# EAGLE design cvocd-a (EAGLE 6.6.0)
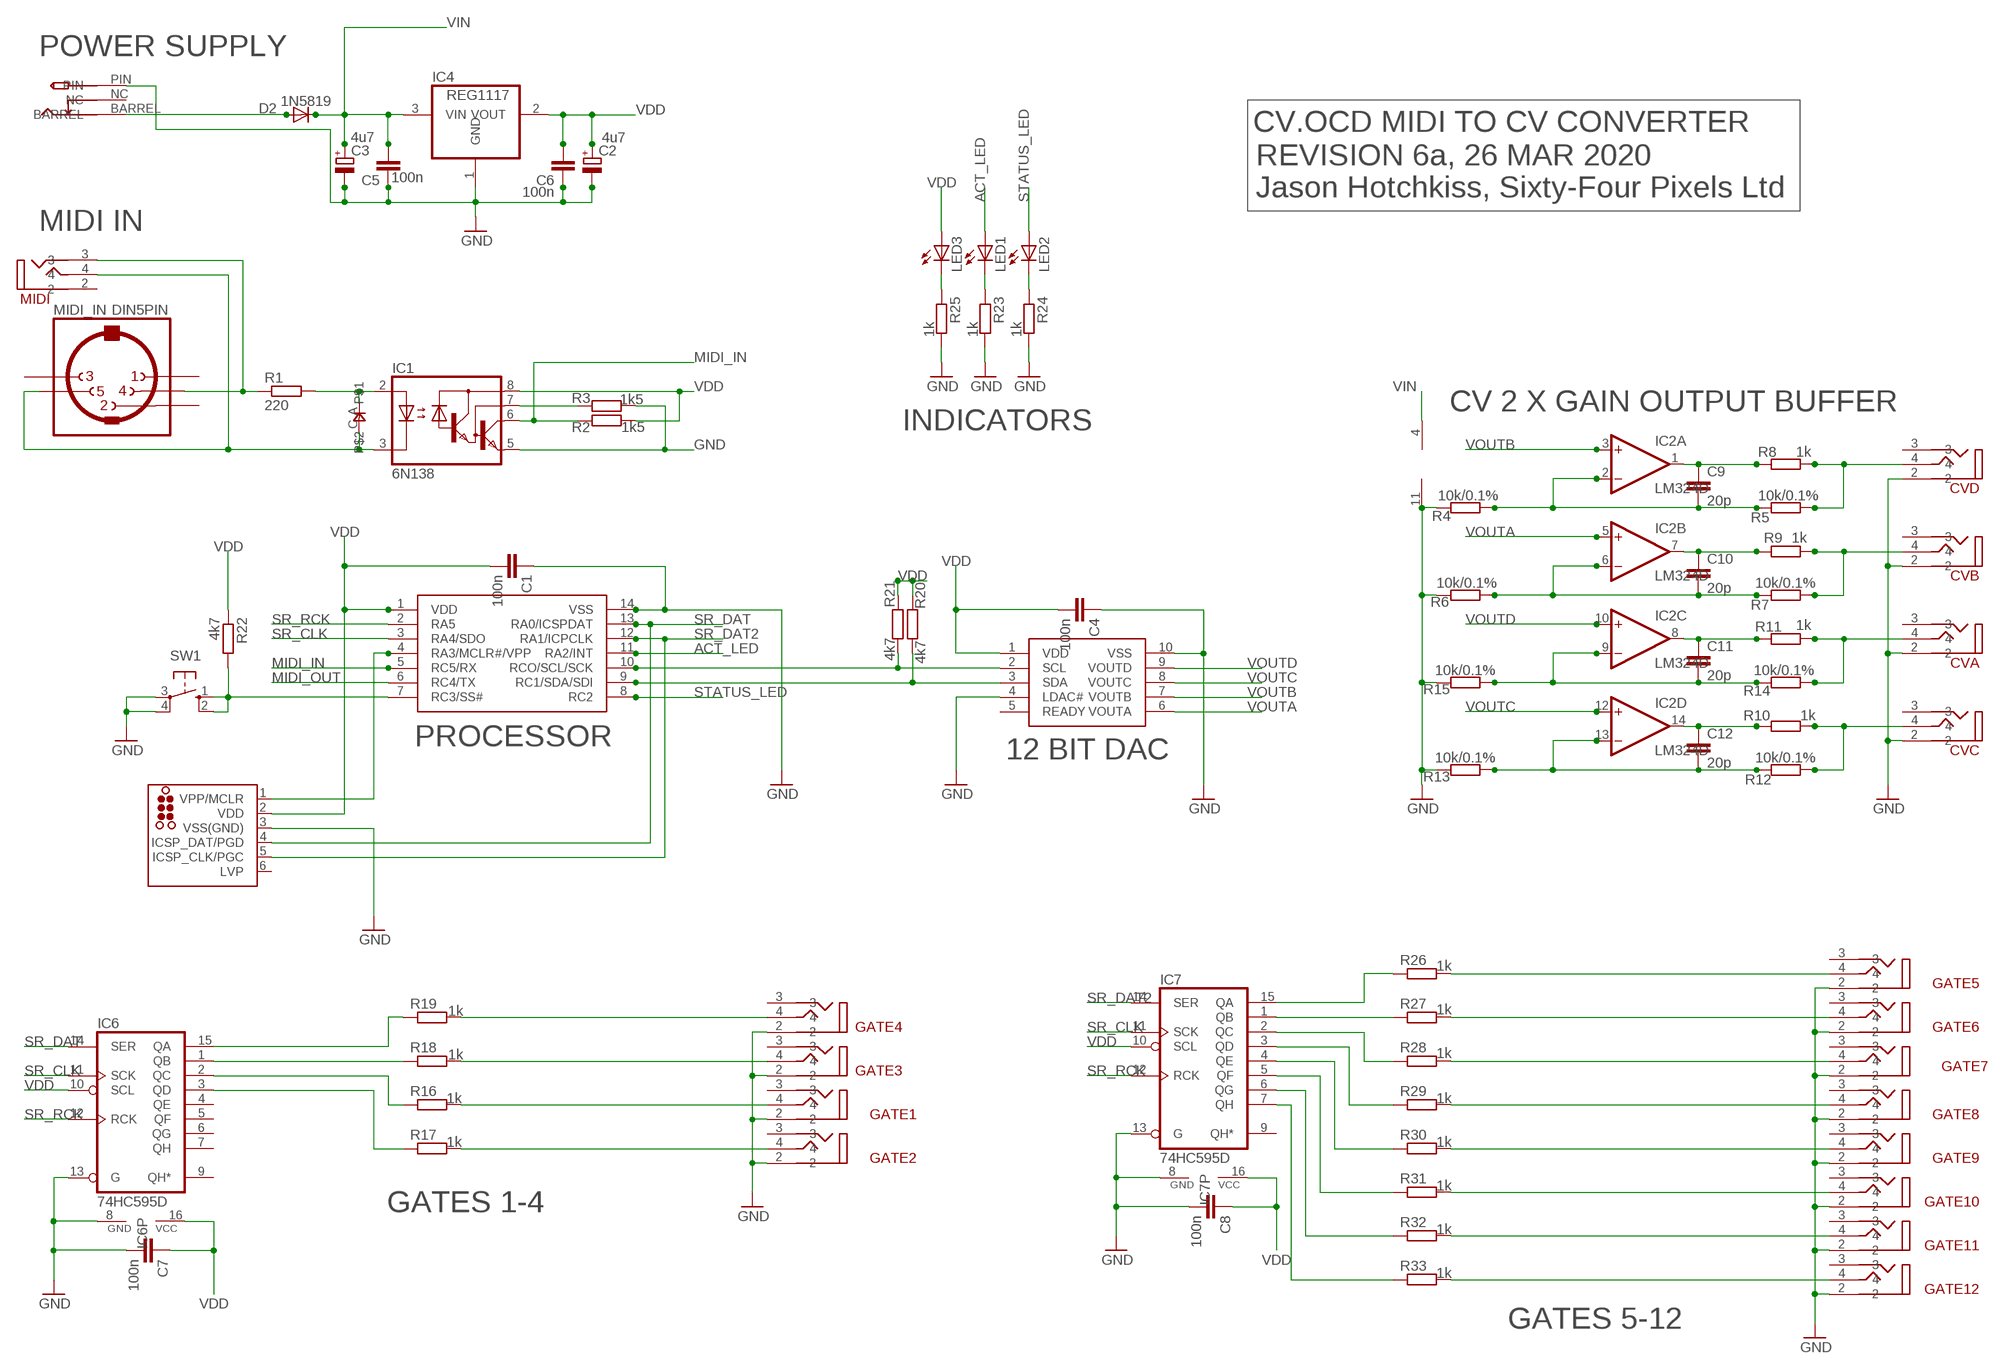
[diagram p0: schematic, sheet 1]

## Parts
C1  100n  C-EUC0805  [C0805]
C2  4u7  CPOL-EUC  [PANASONIC_C]
C3  4u7  CPOL-EUC  [PANASONIC_C]
C4  100n  C-EUC0805  [C0805]
C5  100n  C-EUC0805  [C0805]
C6  100n  C-EUC0805  [C0805]
C7  100n  C-EUC0805  [C0805]
C8  100n  C-EUC0805  [C0805]
C9  20p  C-EUC0805  [C0805]
C10  20p  C-EUC0805  [C0805]
C11  20p  C-EUC0805  [C0805]
C12  20p  C-EUC0805  [C0805]
CVA  VERTICAL_3_5MM_SOCKET  [VERTICAL_3_5MM_SOCKET]
CVB  VERTICAL_3_5MM_SOCKET  [VERTICAL_3_5MM_SOCKET]
CVC  VERTICAL_3_5MM_SOCKET  [VERTICAL_3_5MM_SOCKET]
CVD  VERTICAL_3_5MM_SOCKET  [VERTICAL_3_5MM_SOCKET]
D1  0805DIODE  [0805DIODE]
D2  1N5819  DIODE-SOD123  [SOD123]
GATE1  VERTICAL_3_5MM_SOCKET  [VERTICAL_3_5MM_SOCKET]
GATE2  VERTICAL_3_5MM_SOCKET  [VERTICAL_3_5MM_SOCKET]
GATE3  VERTICAL_3_5MM_SOCKET  [VERTICAL_3_5MM_SOCKET]
GATE4  VERTICAL_3_5MM_SOCKET  [VERTICAL_3_5MM_SOCKET]
GATE5  VERTICAL_3_5MM_SOCKET  [VERTICAL_3_5MM_SOCKET]
GATE6  VERTICAL_3_5MM_SOCKET  [VERTICAL_3_5MM_SOCKET]
GATE7  VERTICAL_3_5MM_SOCKET  [VERTICAL_3_5MM_SOCKET]
GATE8  VERTICAL_3_5MM_SOCKET  [VERTICAL_3_5MM_SOCKET]
GATE9  VERTICAL_3_5MM_SOCKET  [VERTICAL_3_5MM_SOCKET]
GATE10  VERTICAL_3_5MM_SOCKET  [VERTICAL_3_5MM_SOCKET]
GATE11  VERTICAL_3_5MM_SOCKET  [VERTICAL_3_5MM_SOCKET]
GATE12  VERTICAL_3_5MM_SOCKET  [VERTICAL_3_5MM_SOCKET]
IC1  6N138  [DIL08]
IC2  LM324D  [SO14]
IC3  MCP4728_QUAD_DAC  [MSOP10]
IC4  REG1117  [SOT223]
IC5  PIC16F1825SO14  [SO14]
IC6  74HC595D  [SO16]
IC7  74HC595D  [SO16]
ICSP  TC2030-MCP-NL  [TC2030-MCP-NL]
LED1  LED3MM  [LED3MM]
LED2  LED3MM  [LED3MM]
LED3  LED3MM  [LED3MM]
MIDI  VERTICAL_3_5MM_SOCKET  [VERTICAL_3_5MM_SOCKET]
MIDI_IN  DIN5PIN  [EDGEDIN]
R1  220  R-EU_R0805  [R0805]
R2  1k5  R-EU_R0805  [R0805]
R3  1k5  R-EU_R0805  [R0805]
R4  10k/0.1%  R-EU_R0805  [R0805]
R5  10k/0.1%  R-EU_R0805  [R0805]
R6  10k/0.1%  R-EU_R0805  [R0805]
R7  10k/0.1%  R-EU_R0805  [R0805]
R8  1k  R-EU_R0805  [R0805]
R9  1k  R-EU_R0805  [R0805]
R10  1k  R-EU_R0805  [R0805]
R11  1k  R-EU_R0805  [R0805]
R12  10k/0.1%  R-EU_R0805  [R0805]
R13  10k/0.1%  R-EU_R0805  [R0805]
R14  10k/0.1%  R-EU_R0805  [R0805]
R15  10k/0.1%  R-EU_R0805  [R0805]
R16  1k  R-EU_R0805  [R0805]
R17  1k  R-EU_R0805  [R0805]
R18  1k  R-EU_R0805  [R0805]
R19  1k  R-EU_R0805  [R0805]
R20  4k7  R-EU_R0805  [R0805]
R21  4k7  R-EU_R0805  [R0805]
R22  4k7  R-EU_R0805  [R0805]
R23  1k  R-EU_R0805  [R0805]
R24  1k  R-EU_R0805  [R0805]
R25  1k  R-EU_R0805  [R0805]
R26  1k  R-EU_R0805  [R0805]
R27  1k  R-EU_R0805  [R0805]
R28  1k  R-EU_R0805  [R0805]
R29  1k  R-EU_R0805  [R0805]
R30  1k  R-EU_R0805  [R0805]
R31  1k  R-EU_R0805  [R0805]
R32  1k  R-EU_R0805  [R0805]
R33  1k  R-EU_R0805  [R0805]
SW1  10-XX  [B3F-10XX]
U$2  PWR_SOCKET_2_1MM  [PWR_SOCKET_2_1MM]

## Nets
ACT_LED: IC5.11(RA2/INT) LED1.A
GND: C1.1 C2.- C3.- C4.1 C5.1 C6.1 C7.2 C8.2 CVA.2 CVB.2 CVC.2 CVD.2 GATE1.2 GATE2.2 GATE3.2 GATE4.2 GATE5.2 GATE6.2 GATE7.2 GATE8.2 GATE9.2 GATE10.2 GATE11.2 GATE12.2 IC1.5(GND) IC2.11(P:V-) IC3.4(LDAC#) IC3.10(VSS) IC4.1(GND) IC5.14(VSS) IC6.8(GND) IC6.13(G) IC7.8(GND) IC7.13(G) ICSP.3(VSS(GND)) R3.2 R4.1 R6.1 R13.1 R15.1 R23.2 R24.2 R25.2 SW1.3(P) SW1.4(P1) U$2.PIN
MIDI_IN: IC1.6(VO) IC5.5(RC5/RX) R2.1
MIDI_OUT: IC5.6(RC4/TX)
N$1: GATE4.4 R19.2
N$2: C9.1 IC2.1(A:OUT) R8.1
N$3: C10.1 IC2.7(B:OUT) R9.1
N$4: C11.1 IC2.8(C:OUT) R11.1
N$5: C12.1 IC2.14(D:OUT) R10.1
N$6: GATE3.4 R18.2
N$7: GATE1.4 R16.2
N$8: GATE2.4 R17.2
N$9: IC5.7(RC3/SS#) R22.2 SW1.1(S) SW1.2(S1)
N$10: C9.2 IC2.2(A:-IN) R4.2 R5.1
N$11: C11.2 IC2.9(C:-IN) R14.1 R15.2
N$12: IC6.15(QA) R19.1
N$13: IC6.1(QB) R18.1
N$14: C12.2 IC2.13(D:-IN) R12.1 R13.2
N$15: IC6.3(QD) R17.1
N$16: IC6.2(QC) R16.1
N$18: CVD.4 R5.2 R8.2
N$19: CVB.4 R7.2 R9.2
N$20: GATE5.4 R26.2
N$21: IC3.2(SCL) IC5.10(RCO/SCL/SCK) R21.2
N$22: IC3.3(SDA) IC5.9(RC1/SDA/SDI) R20.2
N$23: GATE6.4 R27.2
N$24: GATE7.4 R28.2
N$26: C10.2 IC2.6(B:-IN) R6.2 R7.1
N$29: MIDI.3 MIDI_IN.4 R1.1
N$30: D1.A IC1.2(A) R1.2
N$31: D1.C IC1.3(C) MIDI.4 MIDI_IN.5
N$32: GATE8.4 R29.2
N$33: GATE9.4 R30.2
N$34: IC5.4(RA3/MCLR#/VPP) ICSP.1(VPP/MCLR)
N$35: LED3.K(C) R25.1
N$36: LED1.K(C) R23.1
N$37: LED2.K(C) R24.1
N$38: CVA.4 R11.2 R14.2
N$39: GATE10.4 R31.2
N$40: D2.A U$2.BARREL
N$41: GATE11.4 R32.2
N$42: IC1.7(VB) R3.1
N$43: IC7.15(QA) R26.1
N$44: CVC.4 R10.2 R12.2
N$46: IC7.1(QB) R27.1
N$47: IC7.3(QD) R29.1
N$48: IC7.2(QC) R28.1
N$49: IC7.5(QF) R31.1
N$50: IC7.6(QG) R32.1
N$51: IC7.4(QE) R30.1
N$52: GATE12.4 R33.2
N$53: IC7.7(QH) R33.1
SR_CLK: IC5.3(RA4/SDO) IC6.11(SCK) IC7.11(SCK)
SR_DAT: IC5.13(RA0/ICSPDAT) IC6.14(SER) ICSP.4(ICSP_DAT/PGD)
SR_DAT2: IC5.12(RA1/ICPCLK) IC7.14(SER) ICSP.5(ICSP_CLK/PGC)
SR_RCK: IC5.2(RA5) IC6.12(RCK) IC7.12(RCK)
STATUS_LED: IC5.8(RC2) LED2.A
VDD: C1.2 C2.+ C4.2 C6.2 C7.1 C8.1 IC1.8(VCC) IC3.1(VDD) IC4.2(VOUT) IC5.1(VDD) IC6.10(SCL) IC6.16(VCC) IC7.10(SCL) IC7.16(VCC) ICSP.2(VDD) LED3.A R2.2 R20.1 R21.1 R22.1
VIN: C3.+ C5.2 D2.C IC2.4(P:V+) IC4.3(VIN)
VOUTA: IC2.5(B:+IN) IC3.6(VOUTA)
VOUTB: IC2.3(A:+IN) IC3.7(VOUTB)
VOUTC: IC2.12(D:+IN) IC3.8(VOUTC)
VOUTD: IC2.10(C:+IN) IC3.9(VOUTD)
Unconnected: CVA.3 CVB.3 CVC.3 CVD.3 GATE1.3 GATE2.3 GATE3.3 GATE4.3 GATE5.3 GATE6.3 GATE7.3 GATE8.3 GATE9.3 GATE10.3 GATE11.3 GATE12.3 IC3.5(READY) IC6.4(QE) IC6.5(QF) IC6.6(QG) IC6.7(QH) IC6.9(QH*) IC7.9(QH*) ICSP.6(LVP) MIDI.2 MIDI_IN.1 MIDI_IN.2 MIDI_IN.3 U$2.NC

## Notes on the sheet
- POWER SUPPLY
- CV.OCD MIDI TO CV CONVERTER
- REVISION 6a, 26 MAR 2020
- Jason Hotchkiss, Sixty-Four Pixels Ltd
- MIDI IN
- CV 2 X GAIN OUTPUT BUFFER
- INDICATORS
- PROCESSOR
- 12 BIT DAC
- GATES 1-4
- GATES 5-12

## Library data of the parts
C1 C4-C12 = rcl:C-EU: CAPACITOR, European symbol
C2 C3 = rcl:CPOL-EU: POLARIZED CAPACITOR, European symbol
CVA CVB CVC CVD GATE1-GATE12 MIDI = jason_eagle6:VERTICAL_3_5MM_SOCKET
D1 = jasons_stuff:0805DIODE
D2 = diode:DIODE-: DIODE
IC1 = optocoupler:6N138: MOTOROLA OPTO COUPLER; MF: VISHAY/TELEFUNKEN; MPN: 6N138; OC_FARNELL: 9860150; OC_NEWARK: 35K5294
IC2 = linear:LM324: OP AMP
IC3 = jason_eagle6:MCP4728_QUAD_DAC
IC4 = burr-brown:REG1117: 800mA and 1A Low Dropout (LDO) Positive Regulator 1.8V, 2.5V, 2.85V, 3.3V, 5V, and Adj; MPN: REG1117; OC_FARNELL: 1097566; OC_NEWARK: 14P6981
IC5 = jasons_stuff:PIC16F1825
IC6 IC7 = 74xx-eu:74*595: 8-bit SHIFT REGISTER, output latch
ICSP = tag-connect:TC2030: TAG-CONNECT ICSP Connector Manufacturer: Tag-Connect <http://www.tag-connect.com> Cable for easy In-Circuit Serial Programming. Designed for Microchip ICD2, suitable for many others. Two variants - one "with legs" (for hands-free fit on PCB) and another "without legs" for quick programming. PAD Description 1 MCLR/Vpp 2 Vdd 3 GND 4 PGD (ISPDAT) 5 PGC (ISPCLK) 6 nc (used for LVP) ©2009 ROFA.cz - modified and updated by Robert Darlington ‹rdarlington@gmail.com›
LED1-LED3 = led:LED: LED OSRAM: - CHIPLED LG R971, LG N971, LY N971, LG Q971, LY Q971, LO R971, LY R971 LH N974, LH R974 LS Q976, LO Q976, LY Q976 LO Q996 - Hyper CHIPLED LW Q18S LB Q993, LB Q99A, LB R99A - SideLED LS A670, LO A670, LY A670, LG A670, LP A670 LB A673, LV A673, LT A673, LW A673 LH A674 LY A675 LS A676, LA A676, LO A676, LY A676, LW A676 LS A679, LY A679, LG A679 - Hyper Micro SIDELED® LS Y876, LA Y876, LO Y876, LY Y876 LT Y87S - SmartLED LW L88C, LW L88S LB L89C, LB L89S, LG L890 LS L89K, LO L89K, LY L89K LS L896, LA L896, LO L896, LY L896 - TOPLED LS T670, LO T670, LY T670, LG T670, LP T670 LSG T670, LSP T670, LSY T670, LOP T670, LYG T670 LG T671, LOG T671, LSG T671 LB T673, LV T673, LT T673, LW T673 LH T674 LS T676, LA T676, LO T676, LY T676, LB T676, LH T676, LSB T676, LW T676 LB T67C, LV T67C, LT T67C, LS T67K, LO T67K, LY T67K, LW E67C LS E67B, LA E67B, LO E67B, LY E67B, LB E67C, LV E67C, LT E67C LW T67C LS T679, LY T679, LG T679 LS T770, LO T770, LY T770, LG T770, LP T770 LB T773, LV T773, LT T773, LW T773 LH T774 LS E675, LA E675, LY E675, LS T675 LS T776, LA T776, LO T776, LY T776, LB T776 LHGB T686 LT T68C, LB T68C - Hyper Mini TOPLED® LB M676 - Mini TOPLED Santana® LG M470 LS M47K, LO M47K, LY M47K Source: http://www.osram.convergy.de LUXEON: - LUMILED® LXK2-PW12-R00, LXK2-PW12-S00, LXK2-PW14-U00, LXK2-PW14-V00 LXK2-PM12-R00, LXK2-PM12-S00, LXK2-PM14-U00 LXK2-PE12-Q00, LXK2-PE12-R00, LXK2-PE12-S00, LXK2-PE14-T00, LXK2-PE14-U00 LXK2-PB12-K00, LXK2-PB12-L00, LXK2-PB12-M00, LXK2-PB14-N00, LXK2-PB14-P00, LXK2-PB14-Q00 LXK2-PR12-L00, LXK2-PR12-M00, LXK2-PR14-Q00, LXK2-PR14-R00 LXK2-PD12-Q00, LXK2-PD12-R00, LXK2-PD12-S00 LXK2-PH12-R00, LXK2-PH12-S00 LXK2-PL12-P00, LXK2-PL12-Q00, LXK2-PL12-R00 Source: www.luxeon.com KINGBRIGHT: KA-3528ASYC Source: www.kingbright.com
MIDI_IN = jason_eagle6:DIN5PIN: Female CONNECTOR 5 pins 90 deg. with shield, horizontal (DIN 41524)
R1-R33 = rcl:R-EU_: RESISTOR, European symbol
SW1 = switch-omron:10-XX: OMRON SWITCH; MPN: B3F-1000; OC_FARNELL: 176432; OC_NEWARK: 36M3542
U$2 = jason_eagle6:PWR_SOCKET_2_1MM

## Board
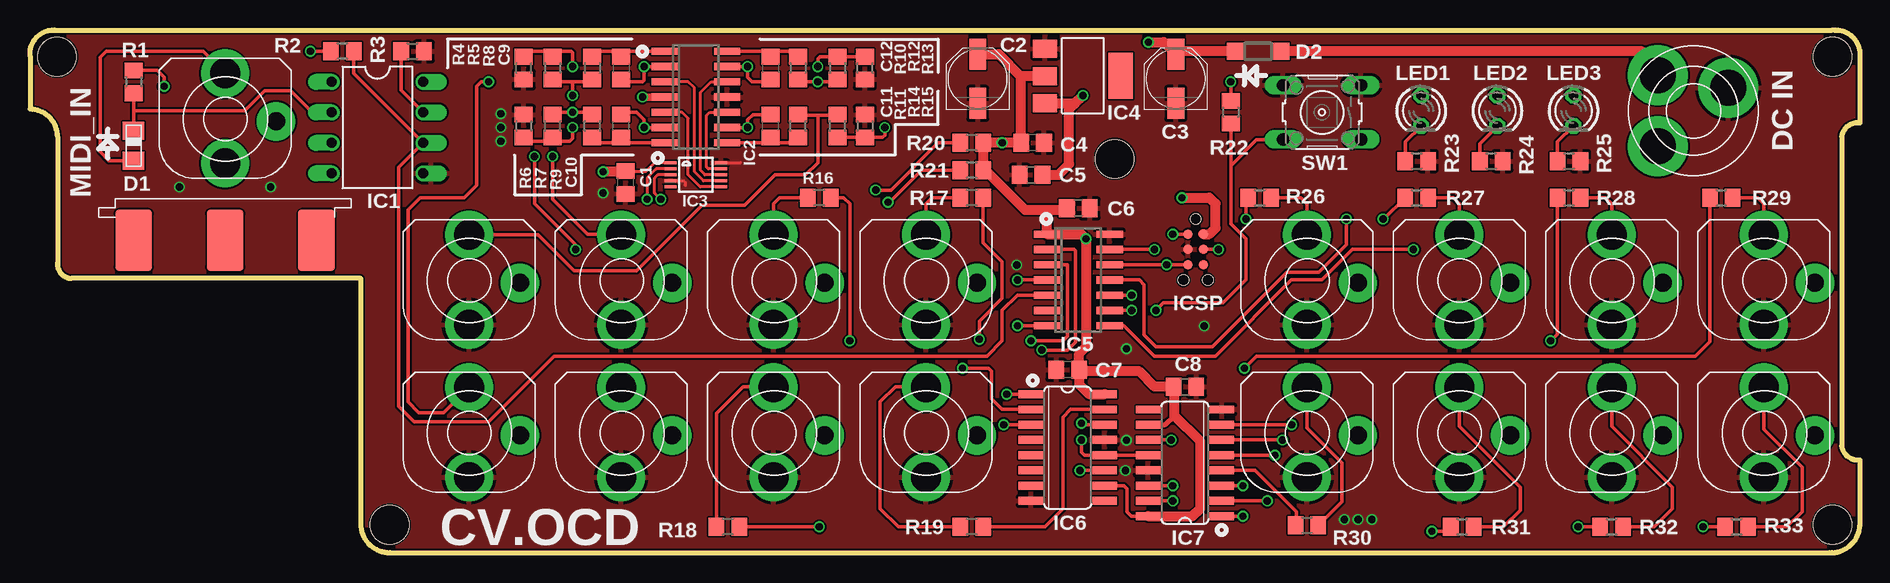
[diagram p1: board, top side]
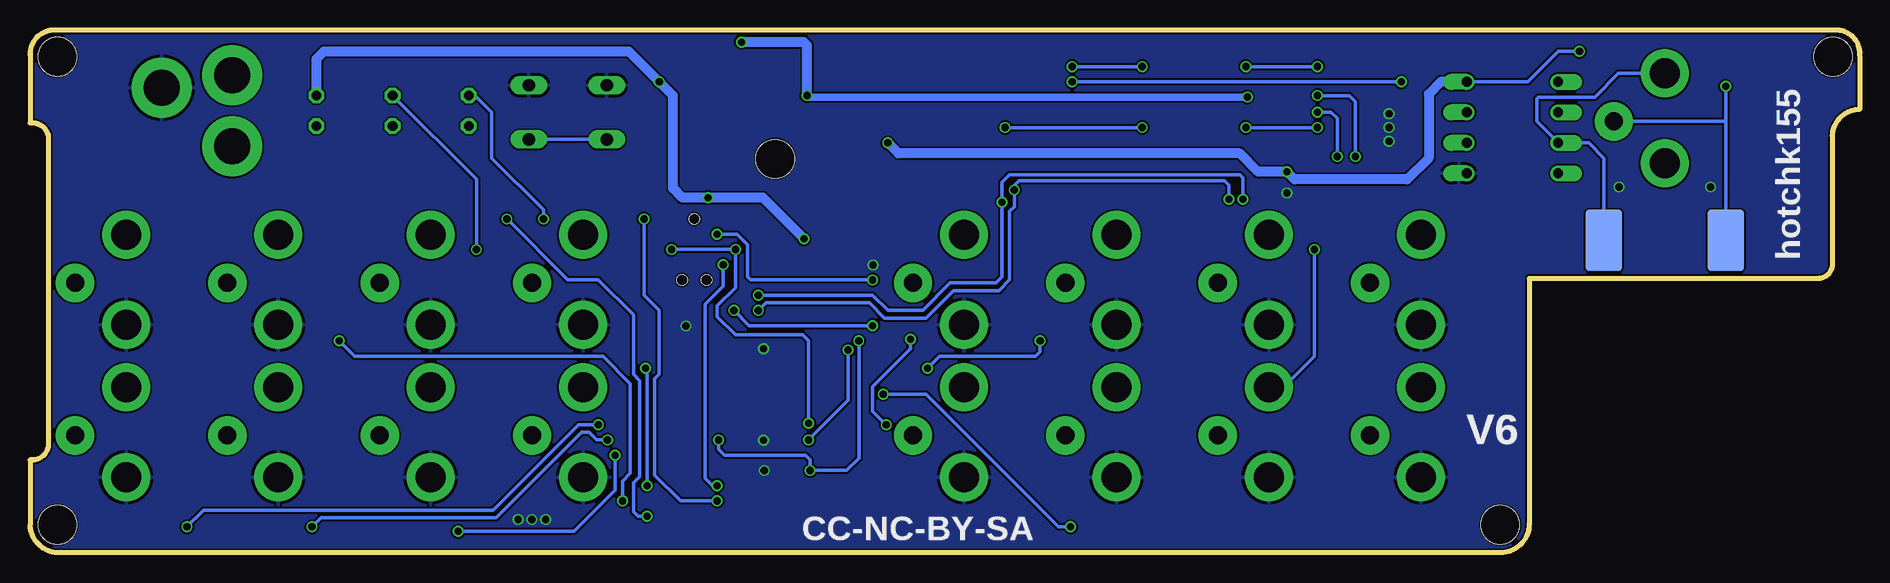
[diagram p2: board, bottom side, seen from below]

Size 152.53 x 43.56 mm. Coordinates in mm from the lower left corner, seen from the top.
Outline: 150.25,43.56 2.04,43.56 arc97 0.01,41.4 0.01,36.96 arc-90 2.29,34.67 2.29,24.13 arc90 3.44,22.86 27.57,22.86 27.57,2.41 arc90 29.98,0 149.99,0 arc90 152.53,2.29 152.53,7.75 arc-90 151.01,8.89 151.01,34.67 arc-90 152.53,35.82 152.53,41.53 arc90 150.5,43.56 150.38,43.56
Copper layers (1*16): Top 0.035mm / dielectric 1.5mm / Bottom 0.035mm
Design rules "hackvana": minimum track width 6mil, minimum drill 0.3mm, track to track 6mil, track to pad 9mil, pad to pad 6mil, via to via 6mil, smd to smd 0mil, copper to edge 6mil, drill to drill 6mil, minimum pad ring 10mil, minimum via ring 6mil, stop-mask expansion 2mil, vias tented up to drill 100mil, thermal gap 10mil
Holes 3.2 mm at 29.98,2.33 150.26,2.33 2.26,41.33 150.26,41.33 90.43,32.82

### Footprints (pad centres in the part's own frame; a part is rotated, then mirrored left to right if it is on the bottom)
C0805 = smd 1.3 x 1.5: 1 -0.95,0; 2 0.95,0
PANASONIC_C = smd 2.6 x 1.4: + 2.05,0; - -2.05,0
VERTICAL_3_5MM_SOCKET = drill 2.5 pad 4: 2 0,-3.75; 4 0,3.75 | drill 1.5 pad 3.2: 3 4.25,-0.25
0805DIODE = smd 1.524 x 1.778: A -1.262,-0.005; C 1.238,-0.005
SOD123 = smd 1.4 x 1.4: A 1.9,0; C -1.9,0
DIL08 = drill 0.813 offset: 1 -3.81,-3.81; 2 -1.27,-3.81; 3 1.27,-3.81; 4 3.81,-3.81; 5 3.81,3.81; 6 1.27,3.81; 7 -1.27,3.81; 8 -3.81,3.81
SO14 = smd 0.6 x 2.2: 1 -3.81,-2.6; 2 -2.54,-2.6; 3 -1.27,-2.6; 4 0,-2.6; 5 1.27,-2.6; 6 2.54,-2.6; 7 3.81,-2.6; 8 3.81,2.6; 9 2.54,2.6; 10 1.27,2.6; 11 0,2.6; 12 -1.27,2.6; 13 -2.54,2.6; 14 -3.81,2.6
MSOP10 = smd 0.25 x 1: 1 -1,-2.113; 2 -0.5,-2.113; 3 0,-2.113; 4 0.5,-2.113; 5 1,-2.113; 6 1,2.113; 7 0.5,2.113; 8 0,2.113; 9 -0.5,2.113; 10 -1,2.113
SOT223 = smd 1.499 x 2.007: 1 -2.261,-3.15; 2 0.025,-3.15; 3 2.311,-3.15 | smd 3.81 x 2.007: 4 0,3.15
SO16 = smd 0.66 x 2.032: 1 -4.445,-3.073; 2 -3.175,-3.073; 3 -1.905,-3.073; 4 -0.635,-3.073; 5 0.635,-3.073; 6 1.905,-3.073; 7 3.175,-3.073; 8 4.445,-3.073; 9 4.445,3.073; 10 3.175,3.073; 11 1.905,3.073; 12 0.635,3.073; 13 -0.635,3.073; 14 -1.905,3.073; 15 -3.175,3.073; 16 -4.445,3.073
TC2030-MCP-NL = smd 0.787 x 0.787: 1 1.27,-0.635; 2 1.27,0.635; 3 2.54,-0.635; 4 2.54,0.635; 5 3.81,-0.635; 6 3.81,0.635 | hole 0.889: 0,0; 5.08,-1.016; 5.08,1.016
LED3MM = drill 0.813 octagon: A -1.27,0; K 1.27,0
EDGEDIN = smd 3.048 x 5.08: 1 -7.62,-10.16; 2 0,-10.16; 3 7.62,-10.16 | smd 3.048 x 5.08 bottom: 4 -5.08,-10.16; 5 5.08,-10.16
R0805 = smd 1.3 x 1.5: 1 -0.95,0; 2 0.95,0
B3F-10XX = drill 1.016 long: 1 -3.251,2.261; 2 3.251,2.261; 3 -3.251,-2.261; 4 3.251,-2.261
PWR_SOCKET_2_1MM = drill 3 pad 5: BARREL 0,4.2; NC -4.2,0; PIN 3.4,-0.7

### Placement (x,y rotation side)
C1  49.66,30.86 90 top
C2  79,39.5 90 top
C3  95.51,39.5 90 top
C4  83.57,34.16 180 top
C5  83.45,31.5 0 top
C6  87.38,28.7 180 top
C7  86.49,15.24 180 top
C8  96.27,13.84 0 top
C9  49.28,40.39 270 top
C10  49.28,35.56 90 top
C11  61.73,35.56 90 top
C12  61.73,40.39 270 top
CVA  36.58,22.73 0 top
CVB  49.28,22.73 0 top
CVC  36.58,10.03 0 top
CVD  49.28,10.03 0 top
D1  8.64,33.91 270 top
D2  102.37,41.78 0 top
GATE1  61.98,22.73 0 top
GATE2  74.68,22.73 0 top
GATE3  61.98,10.03 0 top
GATE4  74.68,10.03 0 top
GATE5  106.43,22.73 0 top
GATE6  119.13,22.73 0 top
GATE7  131.83,22.73 0 top
GATE8  144.53,22.73 0 top
GATE9  106.43,10.03 0 top
GATE10  119.13,10.03 0 top
GATE11  131.83,10.03 0 top
GATE12  144.53,10.03 0 top
IC1  28.96,35.43 270 top
IC2  55.51,37.97 270 top
IC3  55.51,31.5 270 top
IC4  87.76,39.75 270 top
IC5  87.38,22.73 270 top
IC6  86.49,8.76 270 top
IC7  96.27,7.49 90 top
ICSP  97.16,27.81 270 top
LED1  115.96,36.83 270 top
LED2  122.31,36.83 270 top
LED3  128.66,36.83 270 top
MIDI  16.26,36.2 0 top
MIDI_IN  16.26,36.2 0 top
R1  8.64,39.24 270 top
R2  26.04,41.78 180 top
R3  31.88,41.78 0 top
R4  41.16,40.39 90 top
R5  43.57,40.39 270 top
R6  41.16,35.56 270 top
R7  43.57,35.56 90 top
R8  46.87,40.39 270 top
R9  46.87,35.56 90 top
R10  64.02,40.39 270 top
R11  64.02,35.56 90 top
R12  67.32,40.39 270 top
R13  69.6,40.39 90 top
R14  67.32,35.56 90 top
R15  69.6,35.56 270 top
R16  65.79,29.59 180 top
R17  78.49,29.59 180 top
R18  58.17,2.16 180 top
R19  78.49,2.16 180 top
R20  78.49,34.16 180 top
R21  78.49,31.88 180 top
R22  100.08,36.7 270 top
R23  115.58,32.64 0 top
R24  121.8,32.64 0 top
R25  128.28,32.64 0 top
R26  102.5,29.59 0 top
R27  115.58,29.59 0 top
R28  128.28,29.59 0 top
R29  140.98,29.59 0 top
R30  106.43,2.29 0 top
R31  119.39,2.16 0 top
R32  131.83,2.16 0 top
R33  142.25,2.16 0 top
SW1  107.7,36.7 180 top
U$2  138.66,36.83 45 top

### Tracks (layer width: path | path; a pad name or v marks a point on that pad's centre or on a via)
ACT_LED  (via drill 0.6)
  Top 0.305: v109.74,27.81 109.74,25.66 107.45,23.37 104.78,23.37 98.56,17.15 93.86,17.15 92.84,18.16 92.84,22.35 92.46,22.73 IC5.11
  Bottom 0.305: v109.74,27.81 109.74,28.58 114.05,32.89 114.05,36.7 115.32,37.97 115.83,37.97 LED1.A
GND  (via drill 0.6)
  Top 0.254: IC3.4 54.48,31 54.62,30.86 54.62,30.61 | IC3.10 59.17,32.5 59.19,32.51
  other vias: 91.32,6.86 91.4,9.37 91.4,16.99 109.56,2.77 110.7,2.77 111.84,2.77 47.76,29.97 39.25,36.58 82.25,23.98 97.87,18.9 39.25,35.43 39.25,34.29 12.45,30.48 20.07,30.48
  pour Bottom: -4.06,46.86 -4.06,-2.67 154.69,-2.67 154.69,48.13 -4.06,48.13
  pour Top: -1.52,44.32 -1.52,-3.94 155.96,-3.94 155.96,48.13 -1.52,48.13
MIDI_IN
  Top 0.305: IC5.5 82.3,21.46 81.03,20.19 81.03,17.65 79.76,16.38 43.7,16.38 38.23,10.92 37.73,10.92 35.44,10.92 32.01,10.92 30.74,12.19 30.74,32.13 IC1.6 26.99,39.95 R2.1
N$1
  Top 0.305: GATE4.4 74.62,13.84 72.14,13.84 70.87,12.57 70.87,3.68 72.4,2.16 R19.2
N$2
  Top 0.305: R8.1 47.38,41.78 48.84,41.78 C9.1 49.73,41.78 IC2.1
N$3
  Top 0.305: R9.1 47.38,34.16 49.73,34.16 | IC2.7 50.55,34.16 49.73,34.16 | 49.73,34.16 C10.1
N$4
  Top 0.305: R11.1 64.27,34.16 61.86,34.16 61.73,34.29 C11.1 61.28,34.16 IC2.8
N$5
  Top 0.305: IC2.14 61.28,41.78 C12.1 61.73,41.66 61.86,41.78 63.82,41.78 R10.1
N$6
  Top 0.305: R18.2 57.22,11.62 59.44,13.84 61.92,13.84 GATE3.4
N$7
  Top 0.305: R16.2 62.49,29.59 61.98,29.08 GATE1.4
N$8
  Top 0.305: R17.2 75.19,29.59 74.68,29.08 GATE2.4
N$9  (via drill 0.6)
  Top 0.305: IC5.7 v82.3,18.92 | 100.08,32.26 102.24,34.42 104.43,34.42 SW1.2 | v93.86,20.19 94.5,20.83 99.45,20.83 101.35,22.73 101.35,26.16 100.08,27.43 100.08,31.62 100.08,32.26 | R22.2 100.08,32.26
  Bottom 0.305: v82.3,18.92 92.59,18.92 v93.86,20.19 | SW1.2 SW1.1
N$10  (via drill 0.6)
  Top 0.305: IC2.2 v51.19,40.51 51.19,39.37 51.06,39.24 49.48,39.24 C9.2 | R5.1 43.57,41.78 | 43.57,41.78 41.6,41.78 R4.2 | 43.57,41.78 45.09,41.78 45.22,41.66 v45.22,40.51
  Bottom 0.305: v51.19,40.51 v45.22,40.51
N$11  (via drill 0.6)
  Top 0.305: 61.73,36.7 C11.2 60.27,36.51 59.82,36.07 v59.82,35.43 IC2.9 | R14.1 R15.2 71.07,34.61 71.25,34.8 v71.25,35.43
  Bottom 0.305: v59.82,35.43 v71.25,35.43
N$12
  Top 0.305: IC6.15 86.75,11.94 86.11,11.3 86.11,3.68 85.61,3.18 84.59,2.16 R19.1
N$13  (via drill 0.6)
  Top 0.305: IC6.1 v81.41,13.21 | R18.1 v65.79,2.16
  Bottom 0.305: v81.41,13.21 77.86,13.21 66.81,2.16 v65.79,2.16
N$14  (via drill 0.6)
  Top 0.305: IC2.13 v59.82,40.51 59.82,39.63 60.21,39.24 61.73,39.24 C12.2 | R13.2 R12.1 65.85,41.34 65.67,41.15 v65.67,40.51
  Bottom 0.305: v59.82,40.51 v65.67,40.51
N$15  (via drill 0.6)
  Top 0.305: R17.1 79.44,25.85 81.03,24.26 81.03,21.21 79.13,19.31 v79.13,17.78 | v81.16,10.67 IC6.3
  Bottom 0.305: v79.13,17.78 79.13,17.02 82.3,13.84 82.3,11.81 v81.16,10.67
N$16  (via drill 0.6)
  Top 0.305: IC6.2 81.03,11.94 80.14,12.83 80.14,15.11 79.89,15.37 v77.73,15.37 | R16.1 67.83,29.59 68.33,29.08 v68.33,17.65
  Bottom 0.305: v68.33,17.65 68.33,16.77 68.71,16.38 76.72,16.38 76.97,16.13 v77.73,15.37
N$18  (via drill 0.6)
  Top 0.305: v45.47,25.27 45.47,25.66 42.04,29.08 v42.04,33.02 | R8.2 46.81,39.44 46.62,39.24 45.22,39.24 | 45.22,39.24 43.76,39.24 | 43.76,39.24 R5.2 | 43.57,39.24 43.76,39.24 | 45.22,39.24 v45.22,38.1
  Bottom 0.305: CVD.4 48.07,13.78 45.47,16.38 v45.47,25.27 | v45.22,38.1 42.55,38.1 42.04,37.59 v42.04,33.02
N$19  (via drill 0.6)
  Top 0.305: 47.06,36.26 R9.2 46.68,36.7 v45.22,36.7 42.93,36.7 42.93,36.51 R7.2 | v43.57,33.02 43.57,29.47 46.49,26.54 49.22,26.54 CVB.4
  Bottom 0.305: v43.57,33.02 43.57,36.2 44.08,36.7 v45.22,36.7
N$20
  Top 0.305: R26.2 105.93,29.59 106.43,29.08 GATE5.4
N$21  (via drill 0.6)
  Top 0.254: IC3.2 52.2,32 51.44,31.24 v51.44,29.47
  Top 0.305: IC5.10 v91.83,21.46 | v71.51,29.21 71.64,29.21 74.3,31.88 R21.2
  Bottom 0.305: v91.83,21.46 82.3,21.46 81.03,20.19 78.11,20.19 75.83,22.48 72.02,22.48 71.51,22.99 v71.51,29.21 71.51,30.86 70.87,31.5 51.7,31.5 51.44,31.24 v51.44,29.47
N$22  (via drill 0.6)
  Top 0.254: IC3.3 52.33,31.5 52.08,31.24 52.08,29.97 v52.59,29.47
  Top 0.305: IC5.9 v91.83,20.19 | R20.2 75.7,34.16 71.76,30.23 v70.49,30.23
  Bottom 0.305: v52.59,29.47 52.59,30.61 52.97,30.99 70.11,30.99 70.49,30.61 v70.49,30.23 70.49,28.83 70.87,28.45 70.87,22.73 71.76,21.85 75.57,21.85 77.86,19.56 81.29,19.56 82.56,20.83 91.19,20.83 v91.83,20.19
N$23
  Top 0.305: R27.2 118.63,29.59 119.13,29.08 GATE6.4
N$24
  Top 0.305: R28.2 131.33,29.59 131.83,29.08 GATE7.4
N$26  (via drill 0.6)
  Top 0.305: IC2.6 v51.19,35.43 51.19,36.07 50.55,36.7 49.48,36.7 C10.2 | R6.2 41.16,34.29 43.57,34.29 | v45.22,35.43 45.22,34.55 44.97,34.29 43.57,34.29 | 43.57,34.29 R7.1
  Bottom 0.305: v51.19,35.43 v45.22,35.43
N$29  (via drill 0.6)
  Top 0.305: v11.18,38.86 11.18,39.63 10.61,40.19 R1.1
  Bottom 0.305: MIDI_IN.4 11.18,35.82 | 11.18,35.82 v11.18,38.86 | MIDI.3 11.31,35.95 11.18,35.82
N$30
  Top 0.305: R1.2 8.64,36.7 | 8.64,36.7 D1.A | IC1.2 23.5,36.7 21.72,38.48 19.57,38.48 17.91,36.83 8.77,36.83 8.64,36.7
N$31
  Top 0.305: D1.C 6.58,32.67 5.85,33.4 5.85,41.28 6.36,41.78 14.43,41.78 MIDI.4
  Bottom 0.305: MIDI_IN.5 21.34,32.89 22.61,34.16 IC1.3 26.93,35.94 26.93,37.85 26.8,37.97 22.11,37.97 20.13,39.95 MIDI.4
N$32
  Top 0.305: R29.2 144.03,29.59 144.53,29.08 GATE8.4
N$33
  Top 0.305: GATE9.4 106.43,10.42 109.35,7.49 109.35,4.26 R30.2
N$34  (via drill 0.6)
  Top 0.305: v82.3,22.73 IC5.4 | v95.26,26.54 ICSP.1
  Bottom 0.305: v82.3,22.73 92.46,22.73 92.72,22.99 92.72,25.66 93.61,26.54 v95.26,26.54
N$35
  Top 0.305: R25.1 127.33,34.23 LED3.K
N$36
  Top 0.305: R23.1 114.63,34.23 LED1.K
N$37
  Top 0.305: R24.1 120.85,34.1 LED2.K
N$38
  Top 0.305: 64.02,36.7 R11.2 64.21,36.45 65.67,36.45 | CVA.4 42.36,26.48 45.35,23.5 50.55,23.5 56.01,28.96 59.57,28.96 62.11,31.5 64.65,31.5 65.67,32.51 65.67,36.45 | R14.2 67.26,36.45 65.67,36.45
N$39
  Top 0.305: GATE10.4 119.13,10.54 124.21,5.46 124.21,3.56 122.82,2.16 R31.2
N$40
  Top 0.813: U$2.BARREL 135.69,40.47 134.37,41.78 D2.A
N$41
  Top 0.305: R32.2 135.39,2.16 136.91,3.68 136.91,5.46 131.83,10.54 GATE11.4
N$42
  Top 0.305: R3.1 30.93,38.54 IC1.7
N$43  (via drill 0.6)
  Top 0.305: v101.35,27.81 101.35,29.4 R26.1 | IC7.15 v95.26,4.32
  Bottom 0.305: v101.35,27.81 101.35,21.46 100.08,20.19 100.08,14.86 100.46,14.48 100.46,6.48 98.31,4.32 v95.26,4.32
N$44  (via drill 0.6)
  Top 0.305: CVC.4 34.48,11.69 32.39,11.69 31.5,12.57 31.5,28.58 32.52,29.59 36.2,29.59 37.22,30.61 37.22,38.86 37.6,39.24 v38.23,39.24 | R10.2 64.21,39.24 v65.67,39.24 67.12,39.24 R12.2
  Bottom 0.305: v65.67,39.24 v38.23,39.24
N$46  (via drill 0.6)
  Top 0.305: IC7.1 v101.1,3.05 | v112.78,27.81 112.85,27.81 R27.1
  Bottom 0.305: v112.78,27.81 107.7,22.73 105.16,22.73 102.24,19.81 102.24,14.86 101.73,14.35 101.73,6.35 102.24,5.84 102.24,3.43 101.86,3.05 v101.1,3.05
N$47  (via drill 0.6)
  Top 0.305: IC7.3 v101.1,5.59 | R29.1 140.03,17.59 138.82,16.38 102.24,16.38 v101.23,15.37
  Bottom 0.305: v101.1,5.59 101.1,15.24 v101.23,15.37
N$48  (via drill 0.6)
  Top 0.305: IC7.2 v103.13,4.32 | R28.1 127.33,18.23 v126.75,17.65
  Bottom 0.305: v126.75,17.65 125.48,16.38 104.78,16.38 102.5,14.1 102.5,6.61 103.13,5.97 v103.13,4.32
N$49  (via drill 0.6)
  Top 0.305: IC7.5 v103.77,8.13 | v116.85,1.78 118.06,1.78 R31.1
  Bottom 0.305: v116.85,1.78 107.2,1.78 103.77,5.21 v103.77,8.13
N$50  (via drill 0.6)
  Top 0.305: IC7.6 v104.4,9.4 | v129.04,2.16 R32.1
  Bottom 0.305: v129.04,2.16 128.28,2.92 113.67,2.92 106.56,10.03 105.93,10.03 105.29,9.4 v104.4,9.4
N$51
  Top 0.305: IC7.4 102.12,6.86 105.54,3.43 105.54,2.35 R30.1
N$52
  Top 0.305: GATE12.4 144.53,10.29 147.71,7.11 147.71,3.43 146.44,2.16 R33.2
N$53  (via drill 0.6)
  Top 0.305: IC7.7 v105.16,10.67 | v139.45,2.16 R33.1
  Bottom 0.305: v105.16,10.67 106.81,10.67 113.93,3.56 138.06,3.56 v139.45,2.16
SR_CLK  (via drill 0.6)
  Top 0.305: IC7.11 v95.13,9.4 | v87.51,6.86 IC6.11 | IC5.3 86.49,24 86.49,18.04 86.11,17.65 v83.45,17.65
  Bottom 0.305: v95.13,9.4 95.13,8.64 94.62,8.13 87.89,8.13 87.51,7.75 v87.51,6.86 84.46,6.86 83.45,7.88 v83.45,17.65
SR_DAT  (via drill 0.6)
  Top 0.305: IC5.13 v93.73,25.27 | v99.07,25.27 ICSP.4 | IC6.14 87.76,10.67 v87.64,10.8
  Bottom 0.305: v99.07,25.27 v93.73,25.27 93.73,22.1 95.26,20.58 95.26,19.69 93.73,18.16 88.15,18.16 87.64,17.65 v87.64,10.8
SR_DAT2  (via drill 0.6)
  Top 0.305: IC7.14 v95.26,5.59 | ICSP.5 v94.75,24 IC5.12
  Bottom 0.305: v95.26,5.59 95.64,5.59 96.27,6.22 96.27,20.7 94.75,22.23 v94.75,24
SR_RCK  (via drill 0.6)
  Top 0.305: IC7.12 IC6.12 87.89,8.13 87.64,8.38 v87.64,9.4 | IC5.2 87,25.27 87.13,25.15 87.13,17.53 86.49,16.89 v84.34,16.89
  Bottom 0.305: v84.34,16.89 84.34,12.7 v87.64,9.4
STATUS_LED  (via drill 0.6)
  Top 0.305: v115.32,25.27 110.24,25.27 107.7,22.73 105.16,22.73 98.81,16.38 93.73,16.38 91.19,18.92 IC5.8
  Bottom 0.305: v115.32,25.27 115.32,31.12 LED2.A
VDD  (via drill 0.6)
  Top 0.254: 52.86,32.5 IC3.1 52.06,32.5 51.32,31.75 49.73,31.75
  Top 0.305: IC6.10 91.19,5.59 91.45,5.34 91.45,3.43 91.83,3.05 IC7.16 | R22.1 v100.08,39.24 | v23.38,41.78 R2.2 | 49.73,31.75 C1.2
  Top 0.406: IC7.10 94.62,10.67 95.38,11.43
  Top 0.61: 50.01,32.16 C1.2 49.6,31.75
  Top 0.813: 84.84,28.58 82.94,28.58 79.64,31.88 R21.1 R20.1 v81.03,34.16 C4.2 82.62,39.69 82.58,39.73 | 84.84,28.58 86.31,28.58 C6.2 | 84.84,28.58 84.78,28.52 IC5.1 87.64,26.54 v88.02,26.16 88.02,17.15 87.44,16.57 C7.1 | C7.1 87.44,14.04 88.27,13.21 IC6.16 | IC7.16 96.91,3.05 97.54,3.68 97.54,9.27 95.38,11.43 95.38,13.78 C8.1 93.73,13.84 92.46,15.11 87.57,15.11 C7.1 | ICSP.2 98.31,26.54 98.81,27.05 98.81,29.08 98.31,29.59 v96.02,29.59 | IC4.2 82.58,39.73 | C2.+ 80.76,41.55 82.58,39.73 | 49.6,31.75 v47.76,31.75
  Bottom 0.305: IC1.8 27.69,39.24 25.15,41.78 v23.38,41.78
  Bottom 0.813: LED3.A 128.66,41.15 128.02,41.78 102.62,41.78 v100.08,39.24 98.94,38.1 98.94,30.35 98.18,29.59 v96.02,29.59 91.45,29.59 v88.02,26.16 | IC1.8 34.93,39.24 35.95,38.23 35.95,32.89 37.73,31.12 47.12,31.12 v47.76,31.75 50.17,31.75 51.7,33.28 80.14,33.28 v81.03,34.16
VIN  (via drill 0.6)
  Top 0.61: IC2.4 v51.06,37.97
  Top 0.813: C5.2 85.73,31.5 86.62,32.39 86.62,36.96 87.07,37.4 | 87.07,37.4 v87.76,38.1 | IC4.3 87.03,37.44 87.07,37.4 | v93.23,42.55 94.51,42.55 C3.+ 95.75,41.78 D2.C
  Bottom 0.61: v51.06,37.97 87.64,37.97 v87.76,38.1
  Bottom 0.813: v87.76,38.1 87.76,42.29 88.02,42.55 v93.23,42.55
VOUTA
  Top 0.254: IC3.6 55.87,30.5 54.87,31.5 54.87,36.2 54.36,36.7 IC2.5
VOUTB
  Top 0.254: IC3.7 56.13,31 55.38,31.75 55.38,38.74 54.87,39.24 IC2.3
VOUTC
  Top 0.254: IC3.8 56.27,31.5 55.89,31.88 55.89,38.36 56.78,39.24 IC2.12
VOUTD
  Top 0.254: IC3.9 56.53,32 56.4,32.13 56.4,36.45 56.65,36.7 IC2.10

### Text on the board
tPlace: DC IN
tNames: CV.OCD
bNames: hotchk155 | V6 | CC-NC-BY-SA
bDocu: six4pix.com/cvocd